# Altium project BEE-1012 PAY-IF V110.PrjPcb (part 1 of 8)
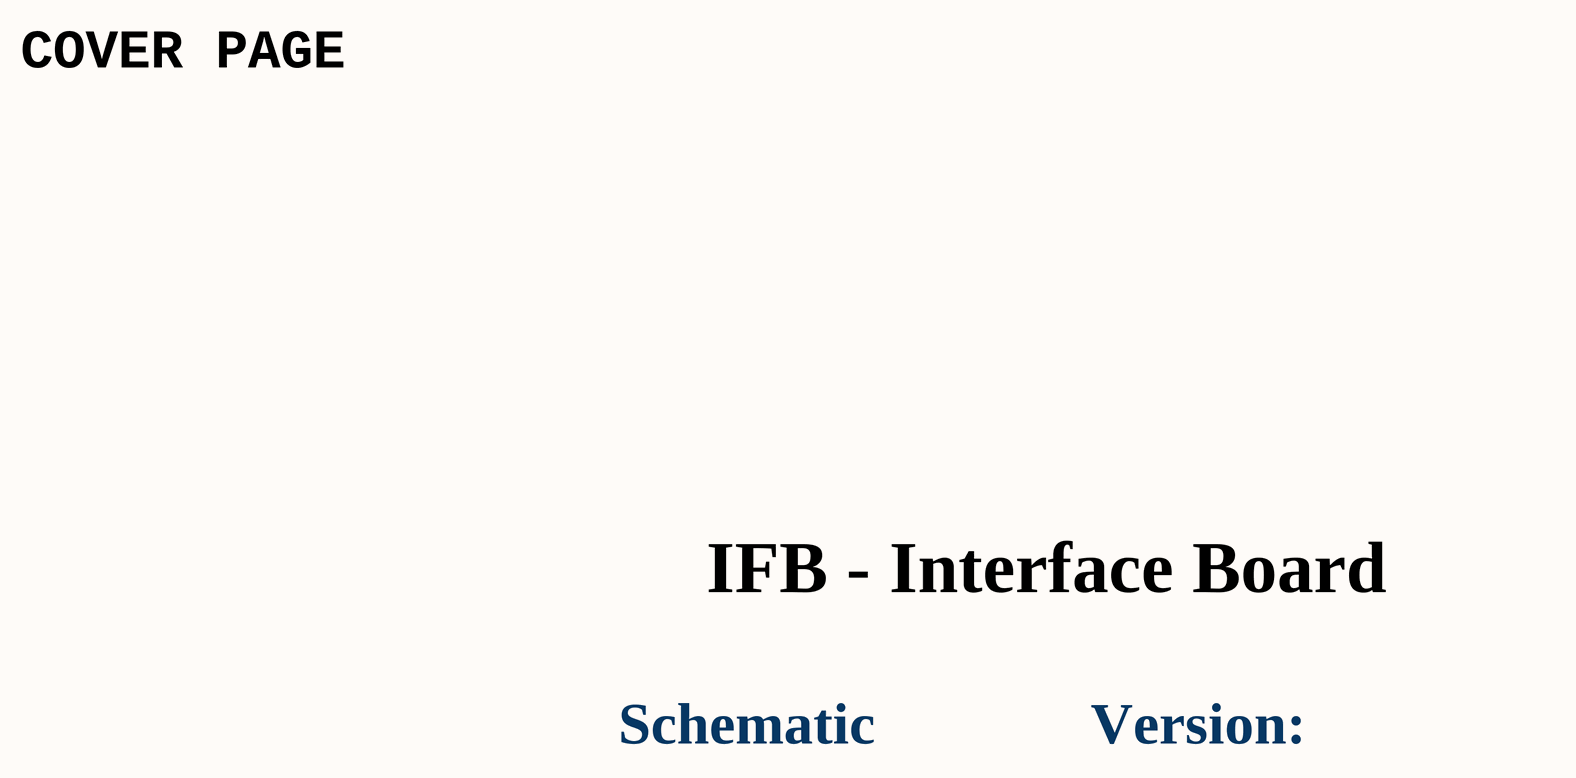
[diagram p0: CoverPage.SchDoc]
ApprovedBy: Vu Pham; Author: Hieu & Duy; CheckedBy: Bao Bui; Project: BEE-1012 PAY-IF V110; ProjectCode: BEE-1012; Revision: Ver 1.1.0; Set_Date: 18/03/2026; Sheet_title: BEE-1012 PAY-IF V110; Sub-system: BEE; Subsystem: BEE
32 sheets, 825 parts. Net scope: flat (ports and power ports of the same name join across sheets).
Board file: BEE-1012 PAY-IF V1.1.0.PcbDoc
Sheets:
  CoverPage.SchDoc
  Index.SchDoc
  PowerTree.SchDoc
  BlockDiagram.SchDoc
  Power.SchDoc
  POWER_MEASUREMENT.SchDoc
  CONNECTOR_EXP.SchDoc
  CONNECTOR_INTERFACE.SchDoc
  SAMA7G54_PMIC.SchDoc
  SAMA7G54_MPU.SchDoc
  SAMA7G54_PIO.SchDoc
  SAMA7G54_DDR3L.SchDoc
  SDCARD_FLASH.SchDoc
  eMMC.SchDoc
  COMM.SchDoc
  USB_SWITCH.SchDoc
  DEBUG_CONSOLE.SchDoc
  TEMP.SchDoc
  RTC.SchDoc
  WATCHDOG.SchDoc
  LVDS.SchDoc
  CAN_PHY.SchDoc
  IMU.SchDoc
  RS485.SchDoc
  RS422.SchDoc
  BUTTON_LED.SchDoc
  MOUNTING_HOLE.SchDoc
  FPGA_POWER.SchDoc
  FPGA_PART1.SchDoc
  FPGA_PART2.SchDoc
  FPGA_extFLASH.SchDoc
  ChangeNote.SchDoc

## Sheet CoverPage.SchDoc
size 420 x 297 mm; SheetNumber: 1; SheetTotal: 32

### Notes on the sheet
- COVER PAGE
- IFB - Interface Board
- Schematic
- Version:
- Project:
- Sub-system:
- Design by:
- Sheet title:
- Sheet
- A3
- of
- Checked by:
- Approved by:
- Revision:
- Document No:
- Size:
- Date:

## Sheet Index.SchDoc
size 420 x 297 mm; SheetNumber: 2; SheetTotal: 32
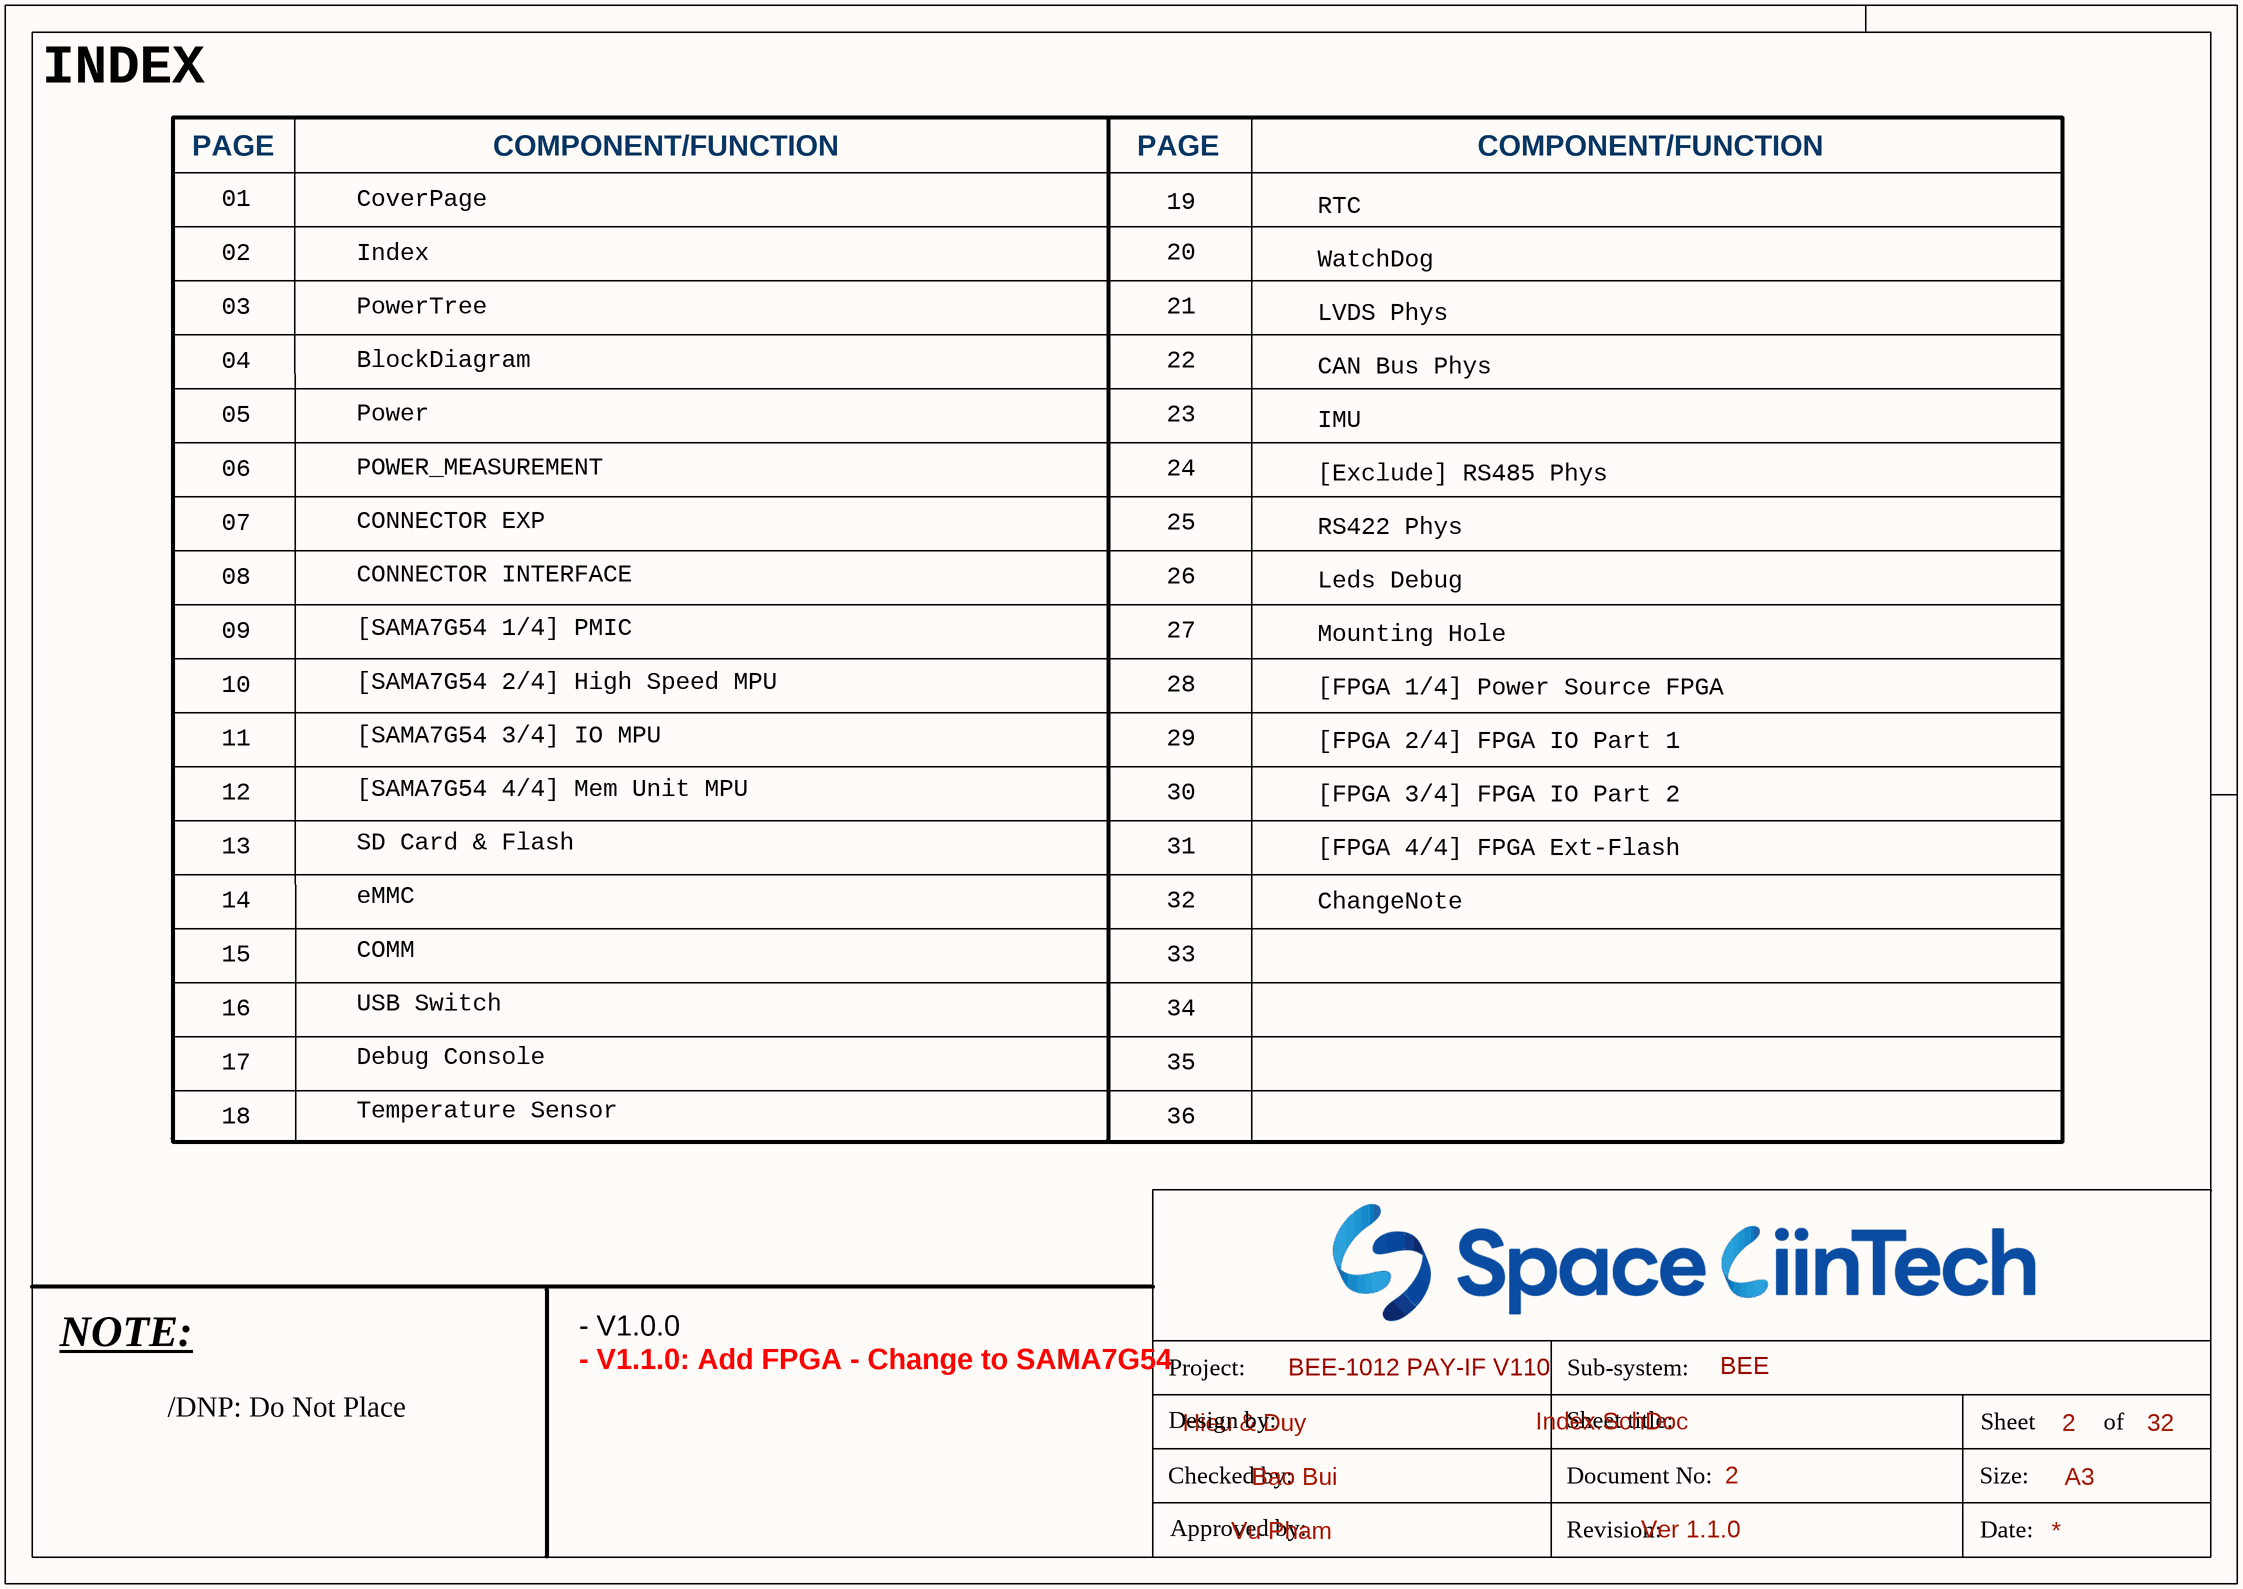
[diagram p1: Index.SchDoc]

### Notes on the sheet
- INDEX
- PAGE
- COMPONENT/FUNCTION
- 01
- 02
- CoverPage
- Index
- 19
- 20
- RTC
- 03
- PowerTree
- 21
- WatchDog
- LVDS Phys
- 04
- BlockDiagram
- 22
- CAN Bus Phys
- 05
- Power
- 23
- IMU
- 06
- 07
- CONNECTOR EXP
- POWER_MEASUREMENT
- 24
- 25
- [Exclude] RS485 Phys
- 08
- CONNECTOR INTERFACE
- 26
- RS422 Phys
- Leds Debug
- 09
- [SAMA7G54 1/4] PMIC
- 27
- Mounting Hole
- 10
- [SAMA7G54 2/4] High Speed MPU
- 28
- [FPGA 1/4] Power Source FPGA
- 11
- 12
- [SAMA7G54 3/4] IO MPU
- [SAMA7G54 4/4] Mem Unit MPU
- 29
- 30
- [FPGA 2/4] FPGA IO Part 1
- 13
- SD Card & Flash
- 31
- [FPGA 3/4] FPGA IO Part 2
- [FPGA 4/4] FPGA Ext-Flash
- 14
- eMMC
- 32
- ChangeNote
- 15
- COMM
- 33
- 16
- 17
- USB Switch
- Debug Console
- 34
- 35
- 18
- Temperature Sensor
- 36
- - V1.0.0
- NOTE:
- - V1.1.0: Add FPGA - Change to SAMA7G54
- /DNP: Do Not Place
- Project:
- Sub-system:
- Design by:
- Sheet title:
- Sheet
- A3
- of
- Checked by:
- Approved by:
- Revision:
- Document No:
- Size:
- Date:

## Sheet PowerTree.SchDoc
size 420 x 297 mm; SheetNumber: 3; SheetTotal: 32

### Notes on the sheet
- Project:
- Sub-system:
- Design by:
- Sheet title:
- Sheet
- A3
- of
- Checked by:
- Approved by:
- Revision:
- Document No:
- Size:
- Date:
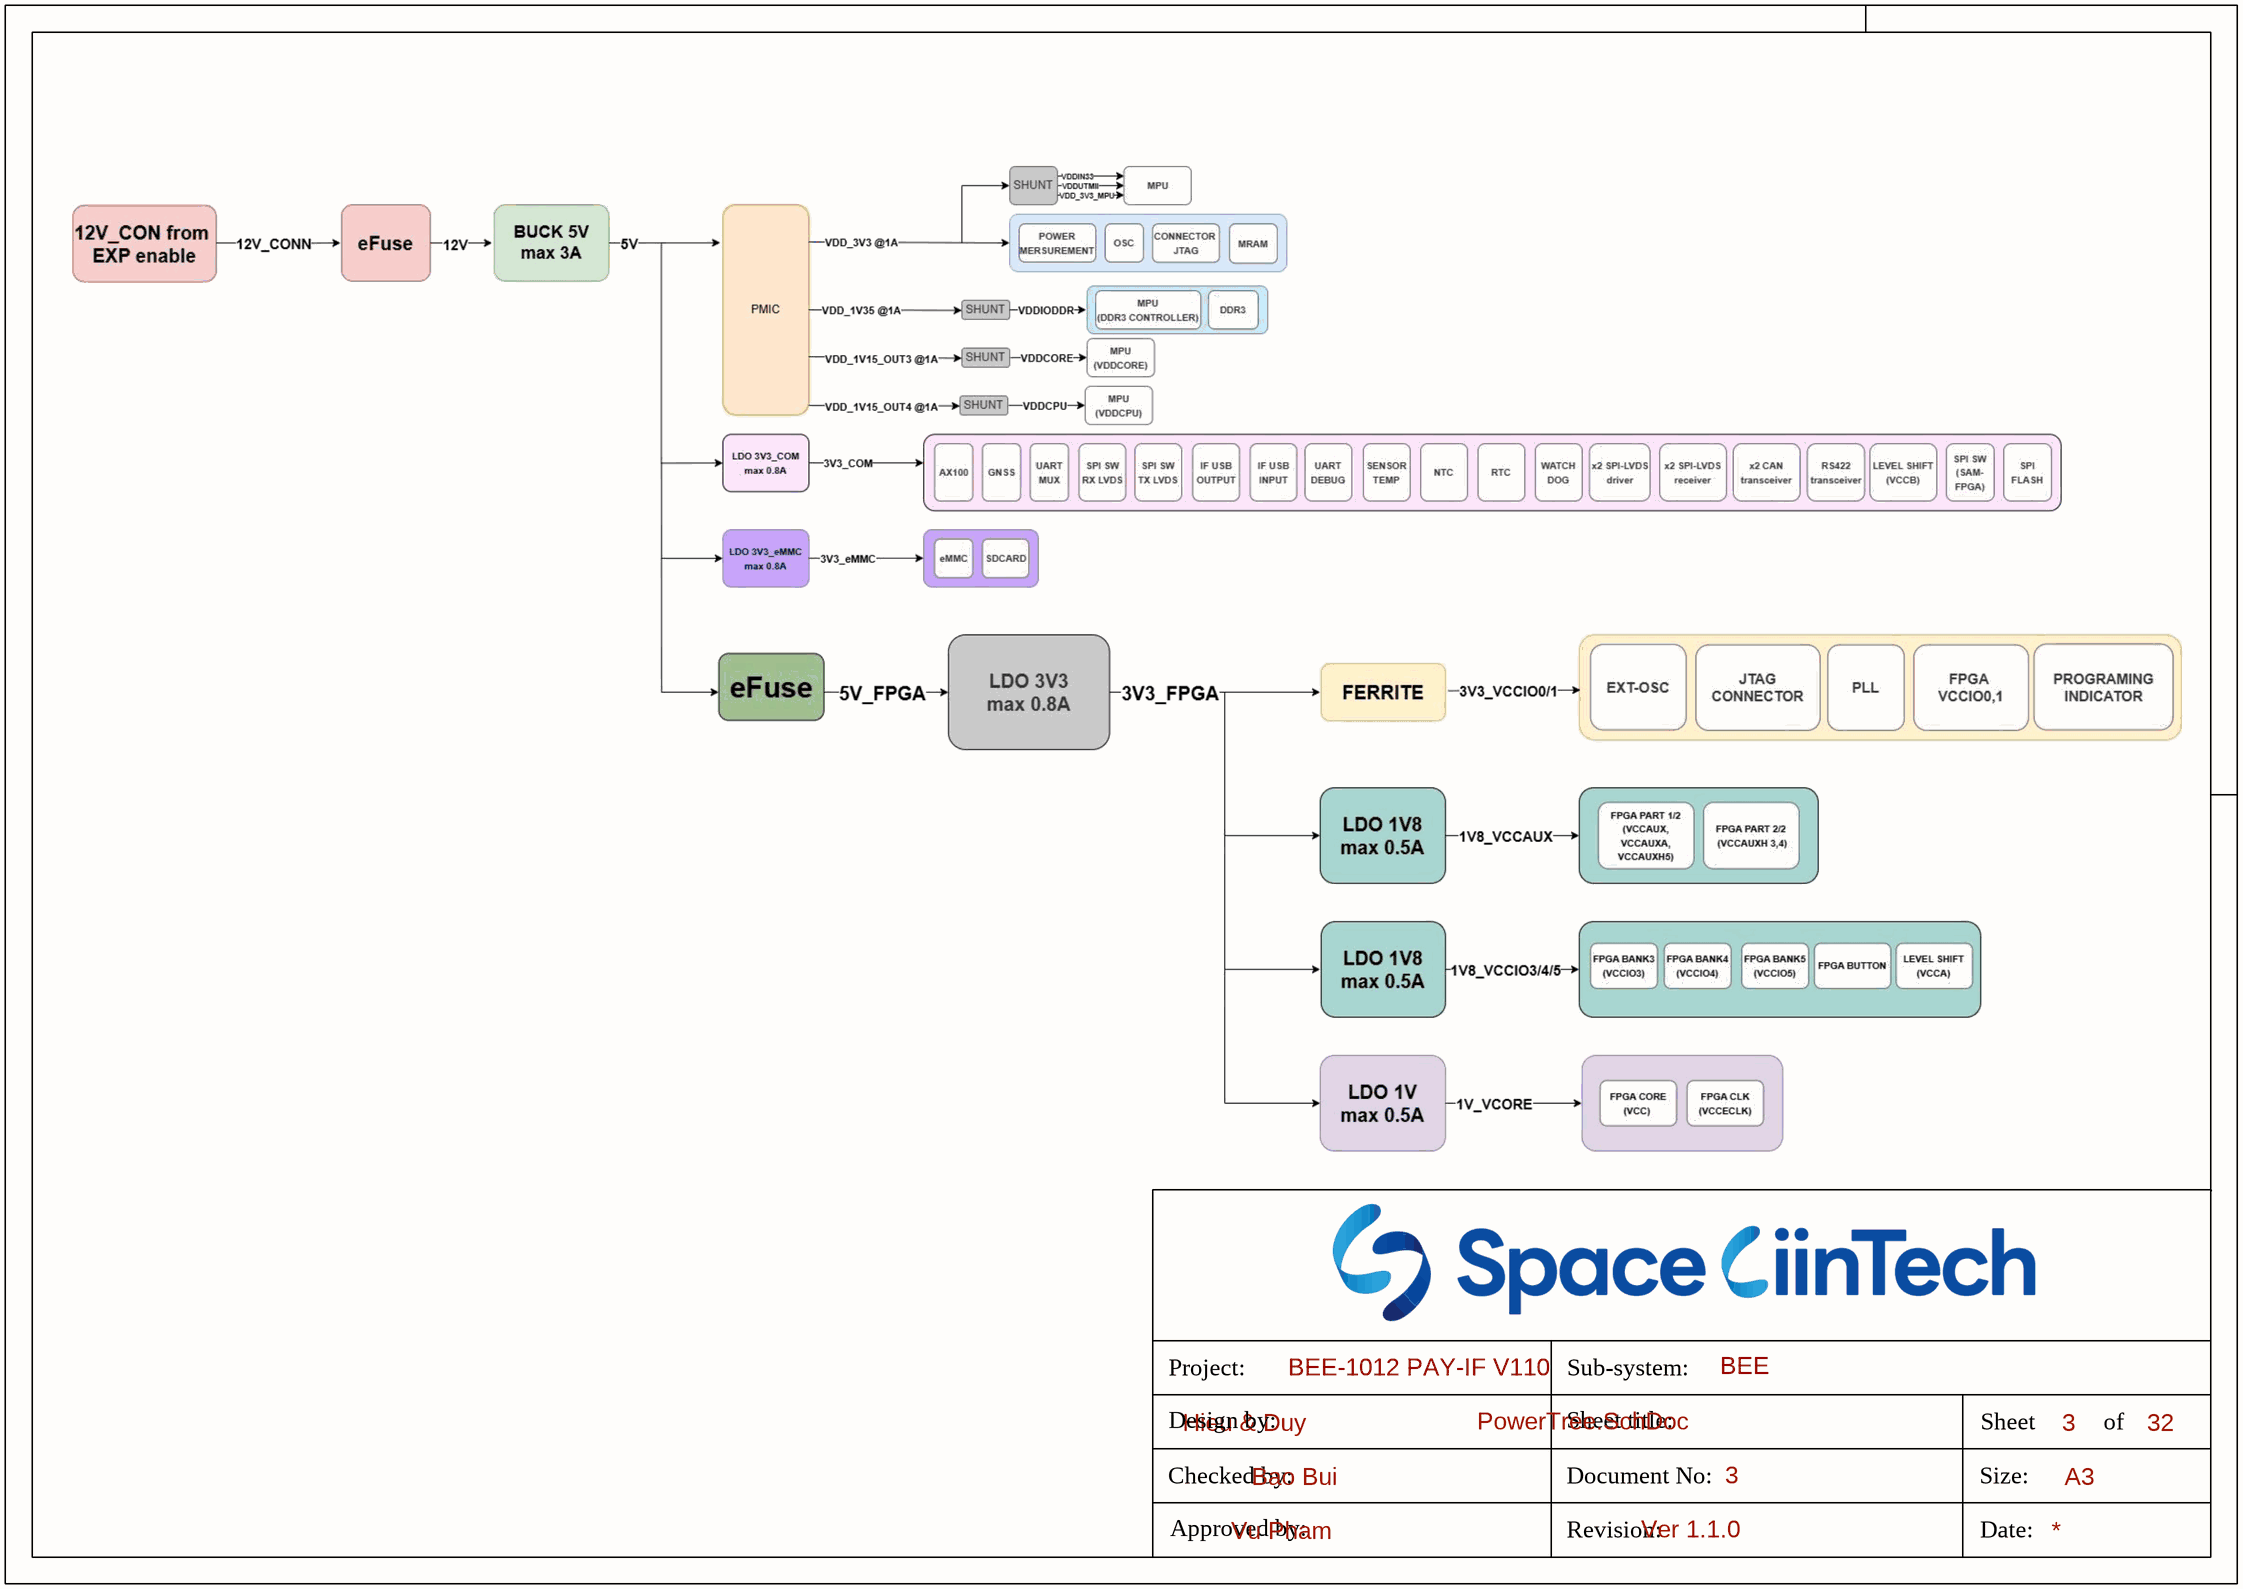
[diagram p2: PowerTree.SchDoc]

## Sheet BlockDiagram.SchDoc
size 420 x 297 mm; SheetNumber: 4; SheetTotal: 32
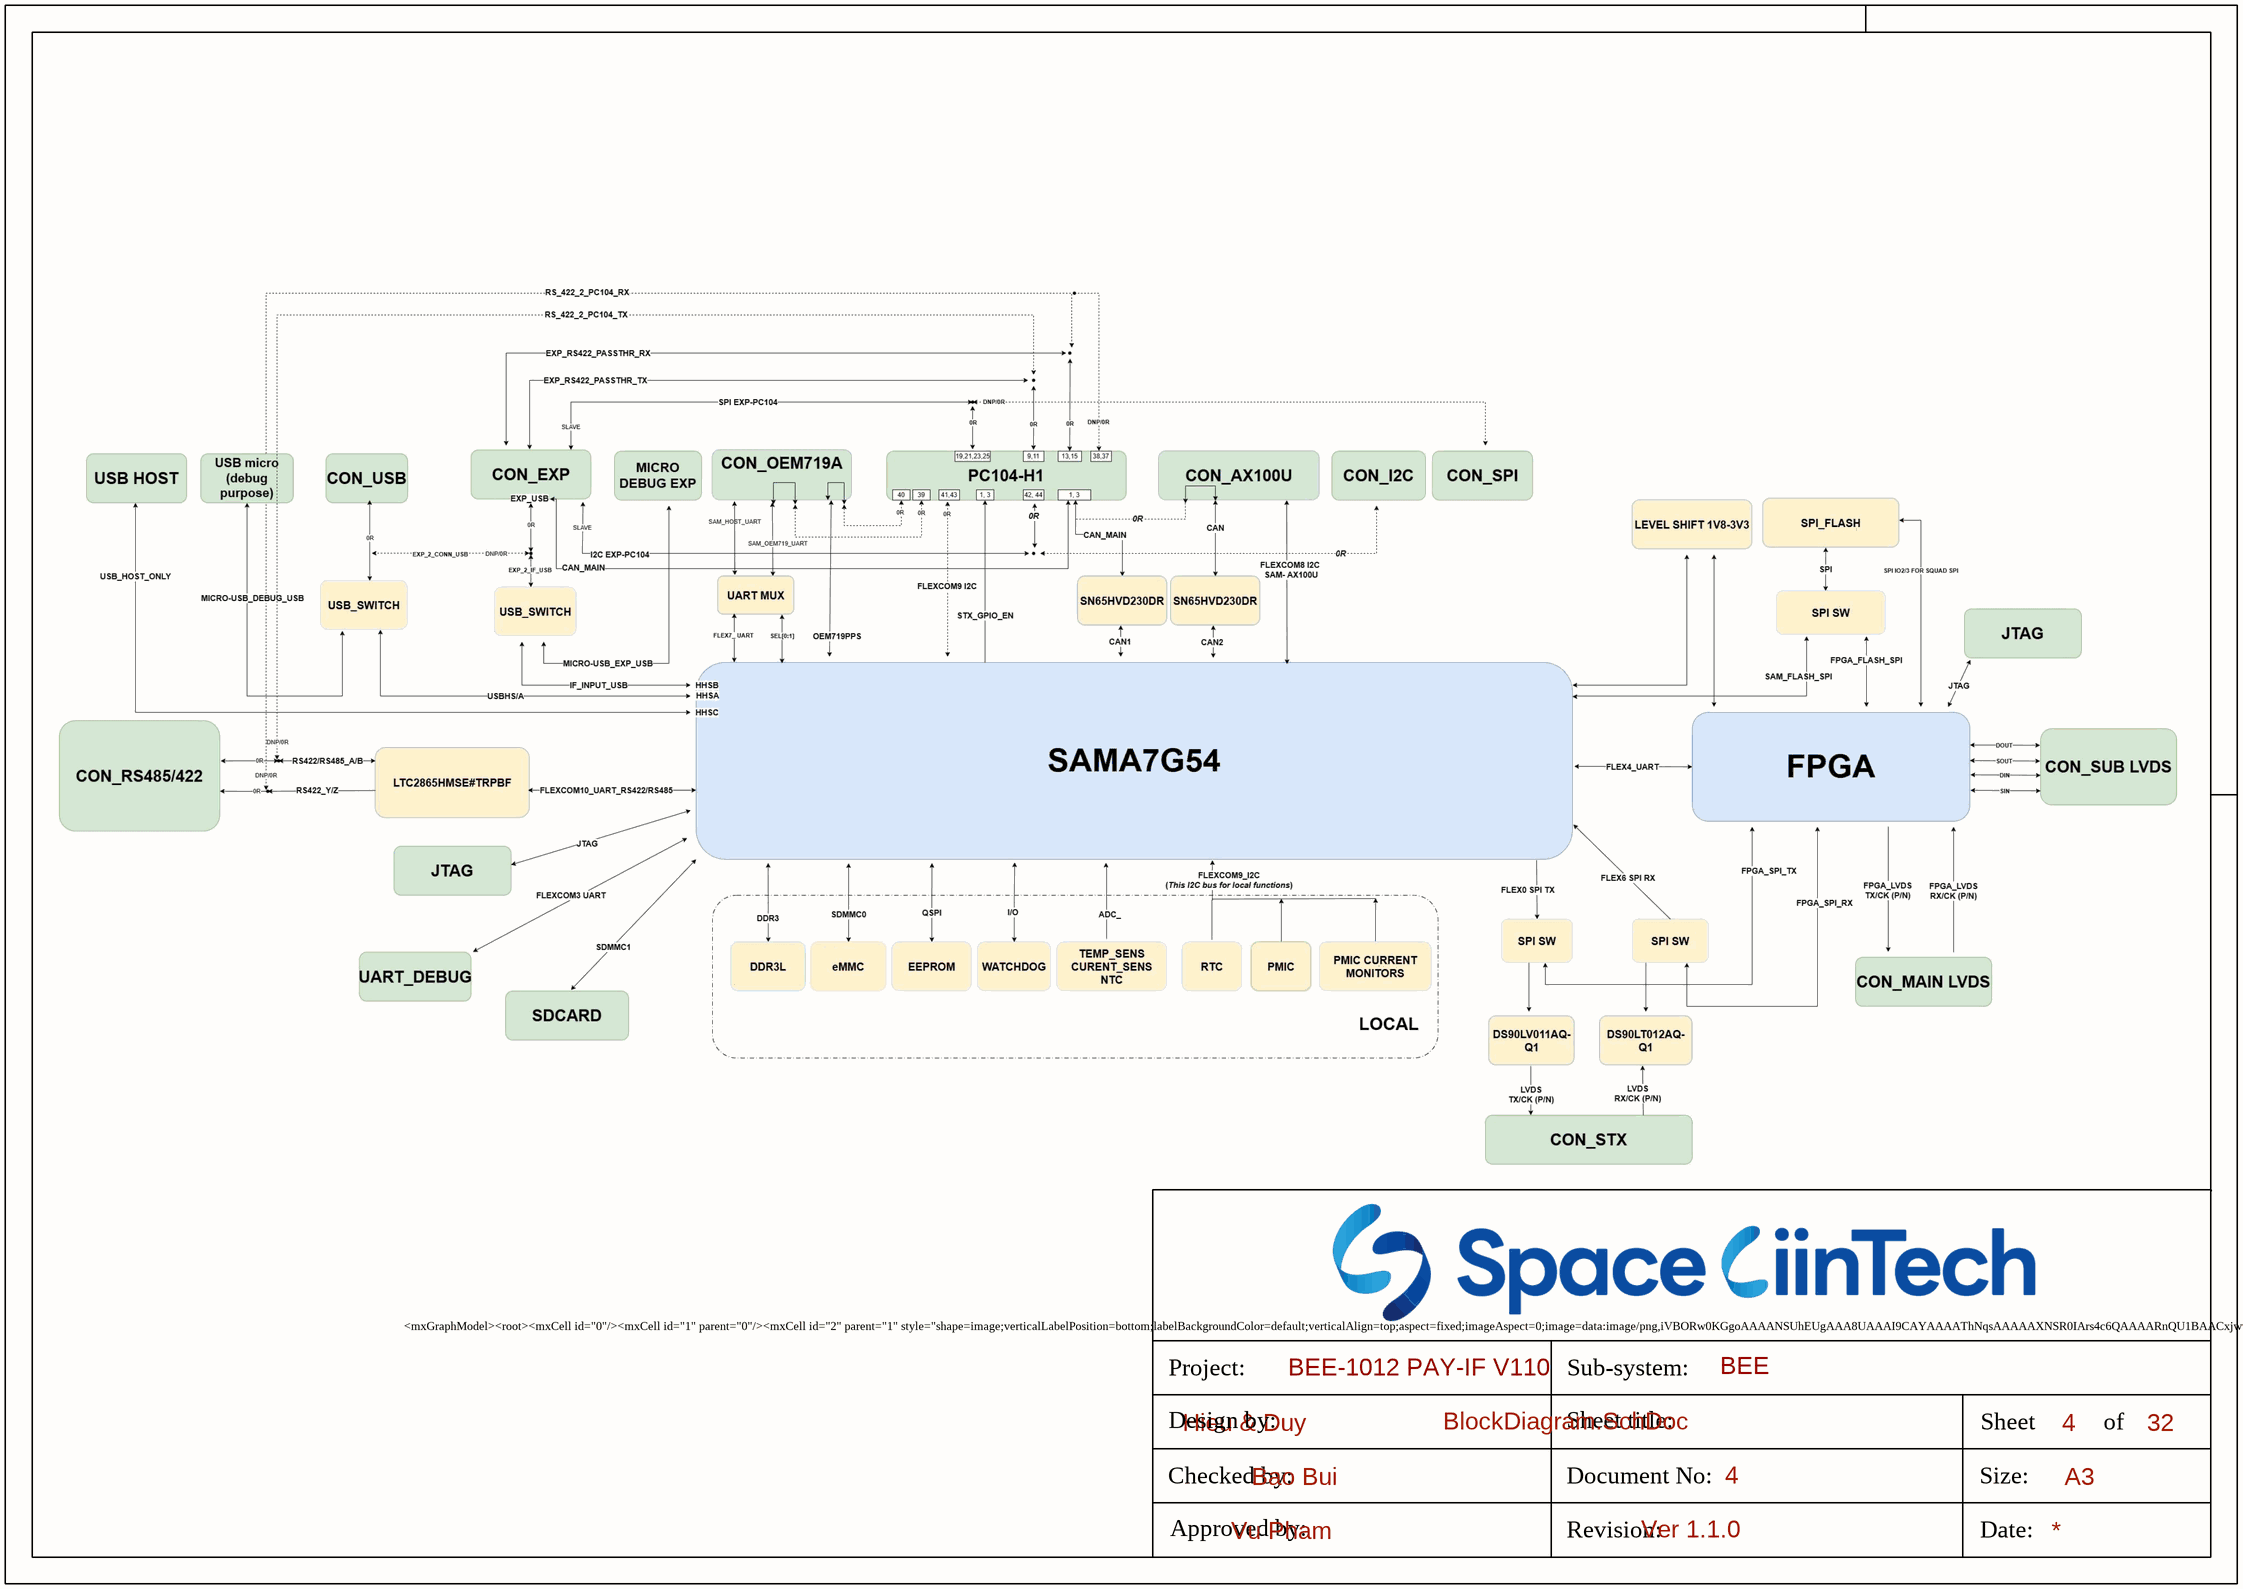
[diagram p3: BlockDiagram.SchDoc]
### Notes on the sheet